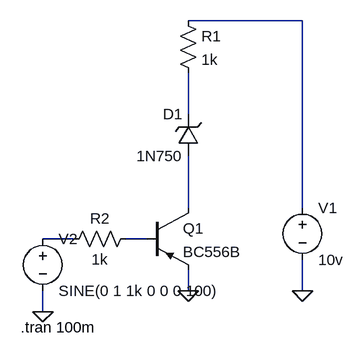
[diagram p0: schematic pnp_level_shift.asc]
pnp_level_shift.asc, the LTspice schematic file:
Version 4
SHEET 1 880 680
WIRE 400 -176 224 -176
WIRE 224 -32 224 -96
WIRE 224 112 224 32
WIRE 400 112 400 -176
WIRE 48 160 0 160
WIRE 160 160 128 160
WIRE 224 240 224 208
WIRE 400 240 400 192
WIRE 0 272 0 240
FLAG 224 240 0
FLAG 400 240 0
FLAG 0 272 0
SYMBOL pnp 160 112 R0
SYMATTR InstName Q1
SYMATTR Value BC556B
SYMBOL res 208 -192 R0
SYMATTR InstName R1
SYMATTR Value 1k
SYMBOL res 144 144 R90
WINDOW 0 0 56 VBottom 2
WINDOW 3 32 56 VTop 2
SYMATTR InstName R2
SYMATTR Value 1k
SYMBOL voltage 400 96 R0
WINDOW 123 0 0 Left 2
WINDOW 39 0 0 Left 2
SYMATTR InstName V1
SYMATTR Value 10v
SYMBOL voltage 0 144 R0
WINDOW 123 0 0 Left 2
WINDOW 39 0 0 Left 2
SYMATTR InstName V2
SYMATTR Value SINE(0 1 1k 0 0 0 100)
SYMBOL zener 240 32 R180
WINDOW 0 24 64 Left 2
WINDOW 3 24 0 Left 2
SYMATTR InstName D1
SYMATTR Value 1N750
TEXT -34 296 Left 2 !.tran 100m

The netlist it stands for:
* pnp_level_shift.asc
Q1 N003 N005 0 0 BC556B
R1 N001 N002 1k
R2 N005 N004 1k
V1 N001 0 10v
V2 N004 0 SINE(0 1 1k 0 0 0 100)
D1 N003 N002 1N750
.model D D
.lib standard.dio
.model NPN NPN
.model PNP PNP
.lib standard.bjt
.tran 100m
.backanno
.end